# EAGLE schematic demonic-cats (EAGLE 6.6.0)
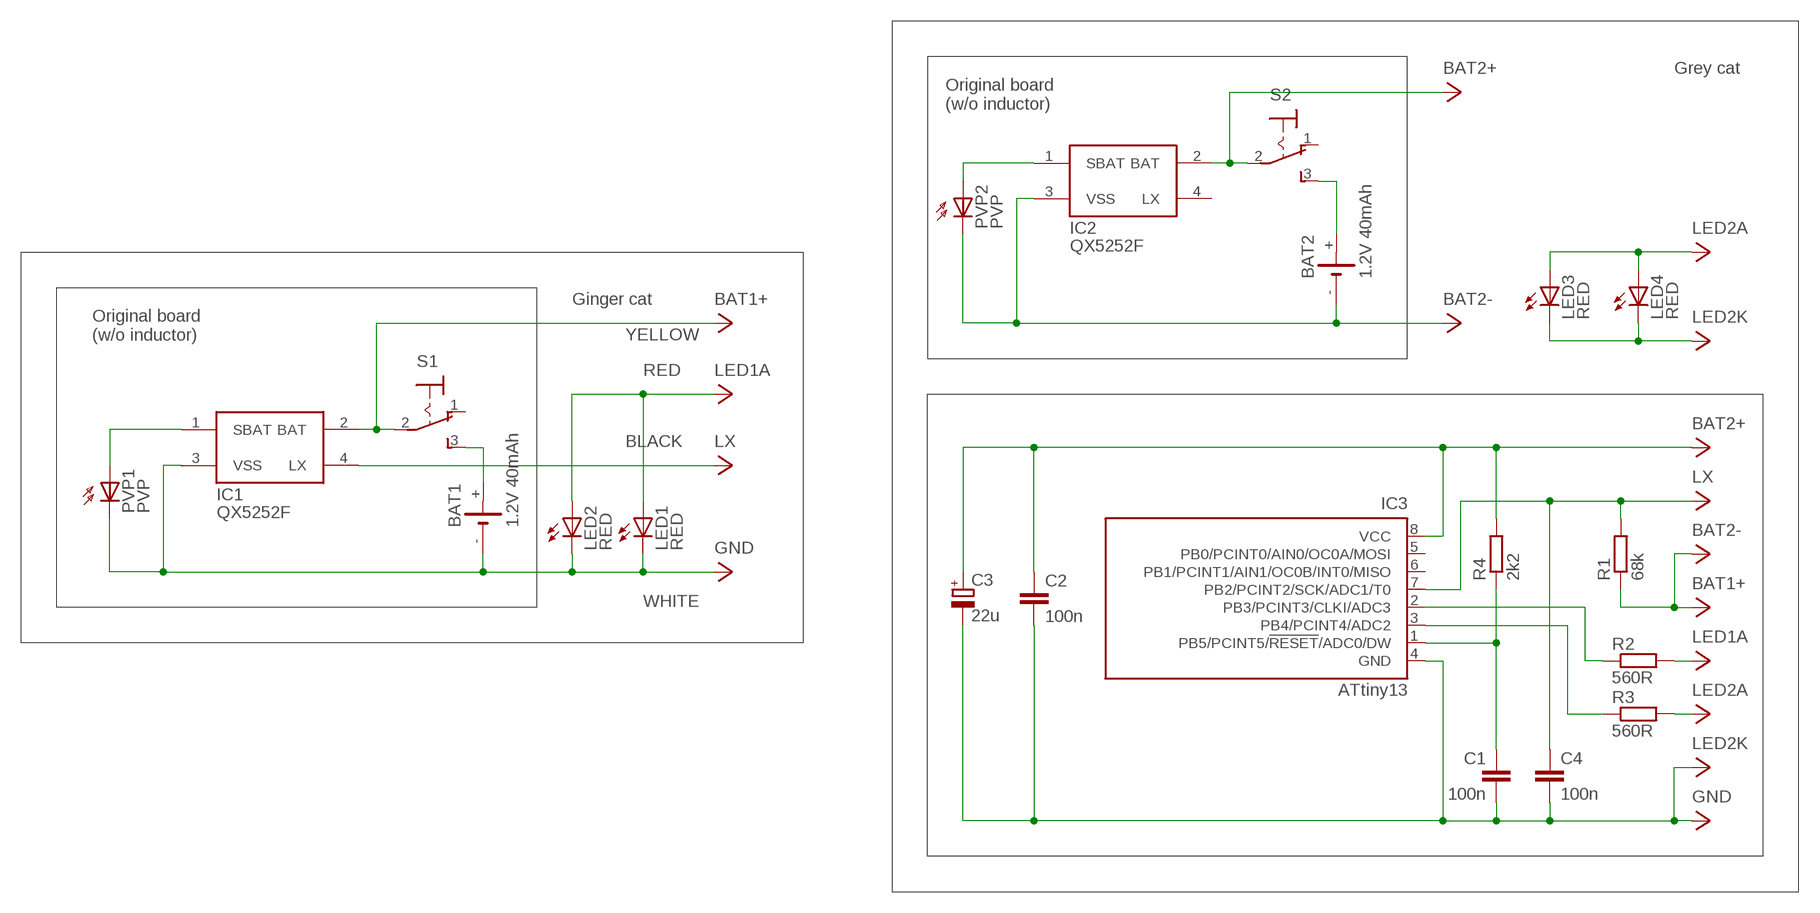
[diagram p0: schematic, sheet 1]

## Parts
BAT1  1.2V 40mAh  SL-150-1/2AA/PR  [SL-150-1/2AA/PR]
BAT2  1.2V 40mAh  SL-150-1/2AA/PR  [SL-150-1/2AA/PR]
C1  100n  C2,5-3  [C2.5-3]
C2  100n  C2,5-3  [C2.5-3]
C3  22u  CPOL-EU085CS-1AR  [085CS_1AR]
C4  100n  C2,5-3  [C2.5-3]
IC1  QX5252F  QX5252  [FAKE4]
IC2  QX5252F  QX5252  [FAKE4]
IC3  ATtiny13  TINY13-20PU  [DIL08]
LED1  RED  LAW57B  [W57B]
LED2  RED  LAW57B  [W57B]
LED3  RED  LAW57B  [W57B]
LED4  RED  LAW57B  [W57B]
PVP1  PVP  BP104  [BP104]
PVP2  PVP  BP104  [BP104]
R1  68k  R  [R0805]
R2  560R  R  [R0805]
R3  560R  R  [R0805]
R4  2k2  R  [R0805]
S1  320-916  [320-916]
S2  320-916  [320-916]

## Nets
N$1: IC2.1(SBAT) PVP2.A
N$2: IC1.1(SBAT) PVP1.A
N$3: BAT2.+ S2.3(S)
N$4: BAT1.+ S1.3(S)
N$5: C1.1 IC3.1(PB5/PCINT5/!RESET!/ADC0/DW) R4.1
N$7: IC3.3(PB4/PCINT4/ADC2) R3.1
N$8: IC3.2(PB3/PCINT3/CLKI/ADC3) R2.1
VCC: BAT1.- BAT2.- C1.2 C2.1 C2.2 C3.+ C3.- C4.1 C4.2 IC1.2(BAT) IC1.3(VSS) IC1.4(LX) IC2.2(BAT) IC2.3(VSS) IC3.4(GND) IC3.7(PB2/PCINT2/SCK/ADC1/T0) IC3.8(VCC) LED1.A LED1.C LED1.C@1(C) LED1.C@2(C) LED1.C@3(C) LED1.C@4(C) LED1.C@5(C) LED2.A LED2.C LED2.C@1(C) LED2.C@2(C) LED2.C@3(C) LED2.C@4(C) LED2.C@5(C) LED3.A LED3.C LED3.C@1(C) LED3.C@2(C) LED3.C@3(C) LED3.C@4(C) LED3.C@5(C) LED4.A LED4.C LED4.C@1(C) LED4.C@2(C) LED4.C@3(C) LED4.C@4(C) LED4.C@5(C) PVP1.K(C) PVP2.K(C) R1.1 R1.2 R2.2 R3.2 R4.2 S1.2(P) S2.2(P) ; supply symbol labelled BAT1+, LED1A, GND, BAT2+, BAT2-, LX, LED2K, LED2A
Unconnected: IC2.4(LX) IC3.5(PB0/PCINT0/AIN0/OC0A/MOSI) IC3.6(PB1/PCINT1/AIN1/OC0B/INT0/MISO) S1.1(O) S2.1(O)

## Notes on the sheet
- Grey cat
- Original board
  (w/o inductor)
- Ginger cat
- Original board
  (w/o inductor)
- YELLOW
- RED
- BLACK
- WHITE

## Library data of the parts
BAT1 BAT2 = battery:SL-150-1/2AA/PR: LI BATTERY Sonnenschein
C1 C2 C4 = capacitor-wima:C: CAPACITOR naming: grid - package width
C3 = rcl:CPOL-EU: POLARIZED CAPACITOR, European symbol
IC1 IC2 = misc:QX5252
IC3 = atmel:TINY13: 8-bit AVR Microcontroller with 1K Bytes In-System Programmable Flash Source: http://www.atmel.com/dyn/resources/prod_documents/2535S.pdf; MPN: ATTINY13-20PU; OC_FARNELL: 9171550; OC_NEWARK: 96K6521
LED1-LED4 = led:*W57B: Golden Dragon® 1 Watt LED Place heat sink pads of cathode with INVOKE Source: www.osram-os.com la_ly_w57b.pdf
PVP1 PVP2 = opto-trans-siemens:BP104: PHOTO DIODE; MF: VISHAY/TELEFUNKEN; MPN: BP104; OC_FARNELL: 1779636; OC_NEWARK: 14M4504
R1-R4 = eagle-ltspice:R: RESISTOR, European symbol; SPICEMODEL: NONE; SPICEPREFIX: R
S1 S2 = switch:320-916: TOGGLE SWITCH distributor RS Components